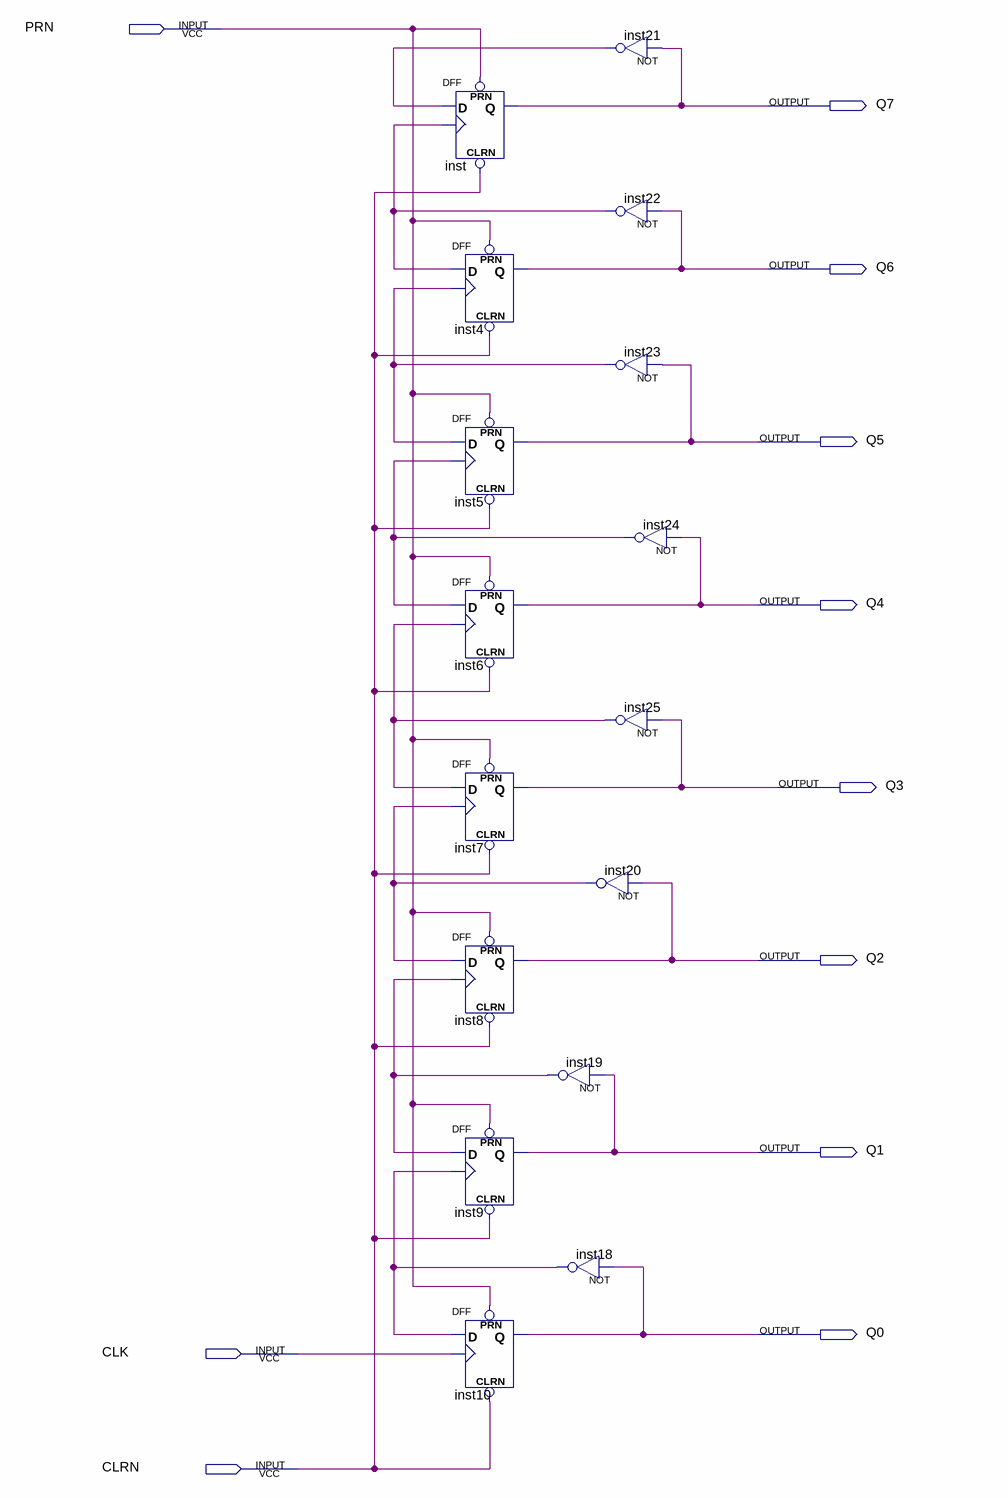
[diagram p0: schematic sheet]
// Quartus schematic counter18.bdf as structural Verilog: 16 symbols, 11 pins
module counter18 (
  input  PRN,
  input  CLK,
  input  CLRN,
  output Q7,
  output Q6,
  output Q5,
  output Q4,
  output Q3,
  output Q2,
  output Q1,
  output Q0
);

  wire inst18_out, inst19_out, inst20_out, inst21_out, inst22_out, inst23_out, inst24_out, inst25_out;

  DFF inst (.CLRN(CLRN), .CLK(inst22_out), .D(inst21_out), .PRN(PRN), .Q(Q7));
  DFF inst4 (.CLRN(CLRN), .CLK(inst23_out), .D(inst22_out), .PRN(PRN), .Q(Q6));
  DFF inst5 (.CLRN(CLRN), .CLK(inst24_out), .D(inst23_out), .PRN(PRN), .Q(Q5));
  DFF inst6 (.CLRN(CLRN), .CLK(inst25_out), .D(inst24_out), .PRN(PRN), .Q(Q4));
  DFF inst7 (.CLRN(CLRN), .CLK(inst20_out), .D(inst25_out), .PRN(PRN), .Q(Q3));
  DFF inst8 (.CLRN(CLRN), .CLK(inst19_out), .D(inst20_out), .PRN(PRN), .Q(Q2));
  DFF inst9 (.CLRN(CLRN), .CLK(inst18_out), .D(inst19_out), .PRN(PRN), .Q(Q1));
  DFF inst10 (.CLRN(CLRN), .CLK(CLK), .D(inst18_out), .PRN(PRN), .Q(Q0));
  not inst19 (inst19_out, Q1);
  not inst18 (inst18_out, Q0);
  not inst21 (inst21_out, Q7);
  not inst22 (inst22_out, Q6);
  not inst23 (inst23_out, Q5);
  not inst24 (inst24_out, Q4);
  not inst25 (inst25_out, Q3);
  not inst20 (inst20_out, Q2);
endmodule
